# Altium schematic sheet PowerMisc.SchDoc
size A4
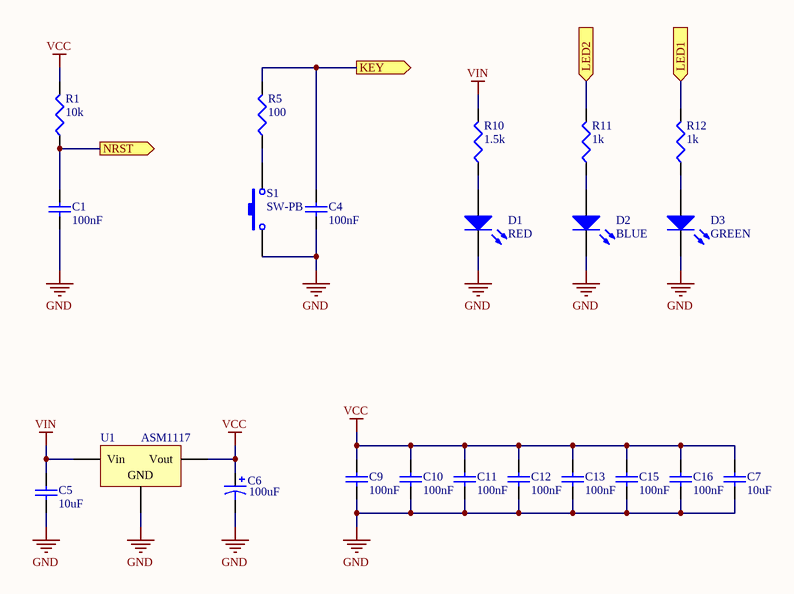
[diagram p0: PowerMisc.SchDoc]

## Parts
C1  value 100nF  [0603C]  (hidden comment: Cap)
C4  value 100nF  [0603C]  (hidden comment: Cap)
C5  value 10uF  [1206C]  (hidden comment: Cap)
C6  value 100uF  [CAP3528T]  (hidden comment: Cap Pol3)
C7  value 10uF  [0805C]  (hidden comment: Cap)
C9  value 100nF  [0603C]  (hidden comment: Cap)
C10  value 100nF  [0603C]  (hidden comment: Cap)
C11  value 100nF  [0603C]  (hidden comment: Cap)
C12  value 100nF  [0603C]  (hidden comment: Cap)
C13  value 100nF  [0603C]  (hidden comment: Cap)
C15  value 100nF  [0603C]  (hidden comment: Cap)
C16  value 100nF  [0603C]  (hidden comment: Cap)
D1  RED  [0603LED]
D2  BLUE  [0603LED]
D3  GREEN  [0603LED]
R1  value 10k  [0603R]  (hidden comment: Res3)
R5  value 100  [0603R]  (hidden comment: Res3)
R10  value 1.5k  [0603R]  (hidden comment: Res3)
R11  value 1k  [0603R]  (hidden comment: Res3)
R12  value 1k  [0603R]  (hidden comment: Res3)
S1  SW-PB  [SPST-SM2]
U1  ASM1117  [SOT223]

## Ports
KEY (out), LED1 (in), LED2 (in), NRST (out)

## Nets
GND: C1.2 C4.2 C5.2 C6.2 C7.2 C9.2 C10.2 C11.2 C12.2 C13.2 C15.2 C16.2 D1.2(K) D2.2(K) D3.2(K) S1.1 U1.2(GND)
VCC: C6.1 C7.1 C9.1 C10.1 C11.1 C12.1 C13.1 C15.1 C16.1 R1.2 U1.3(Vout)
VIN: C5.1 R10.2 U1.1(Vin)
KEY: C4.1 R5.2 ; port KEY
LED1: R12.2 ; port LED1
LED2: R11.2 ; port LED2
NRST: C1.1 R1.1 ; port NRST
NetD1_1: D1.1(A) R10.1
NetD2_1: D2.1(A) R11.1
NetD3_1: D3.1(A) R12.1
NetR5_1: R5.1 S1.2

## Library data of the parts
C1 C4 C5 C7 C9-C13 C15 C16 = Cap: Capacitor; Published: 8-Jun-2000; LatestRevisionDate: 17-Jul-2002; LatestRevisionNote: Re-released for DXP Platform.; PackageReference: CAPC2012L; Publisher: Altium Limited
C6 = Cap Pol3: Polarized Capacitor (Surface Mount); Published: 8-Jun-2000; LatestRevisionDate: 29-May-2009; LatestRevisionNote: IPC-7351 Footprint Added.; PackageReference: C0805; Publisher: Altium Limited; PackageDescription: Chip Capacitor
D1-D3 = LED1: Typical RED GaAs LED; Published: 8-Jun-2000; LatestRevisionDate: 08-Jul-2005; LatestRevisionNote: Mech Layer 1 removed.; PackageReference: LED-1; Publisher: Altium Limited
R1 R5 R10-R12 = Res3: Resistor; Published: 8-Jun-2000; LatestRevisionDate: 29-May-2009; LatestRevisionNote: IPC-7351 Footprint Added.; PackageReference: J1-0603; Publisher: Altium Limited; PackageDescription: Chip Resistor
S1 = SW-PB: Switch; Published: 24-Mar-1999; LatestRevisionDate: 17-Jul-2002; LatestRevisionNote: Re-released for DXP Platform.; PackageReference: SPST-2; Publisher: Altium Limited
U1 = Volt Reg: Voltage Regulator; pin to pad: 1>3 2>1+4 3>2; Published: 24-Mar-1999; LatestRevisionDate: 29-May-2009; LatestRevisionNote: IPC-7351 Footprint Added.; PackageReference: D2PAK; Publisher: Altium Limited; PackageDescription: 3-Pin Transistor Outline Package 2.54 mm Pitch, 15.1 mm Lead Span